# EAGLE schematic Atmega (EAGLE 6.2)
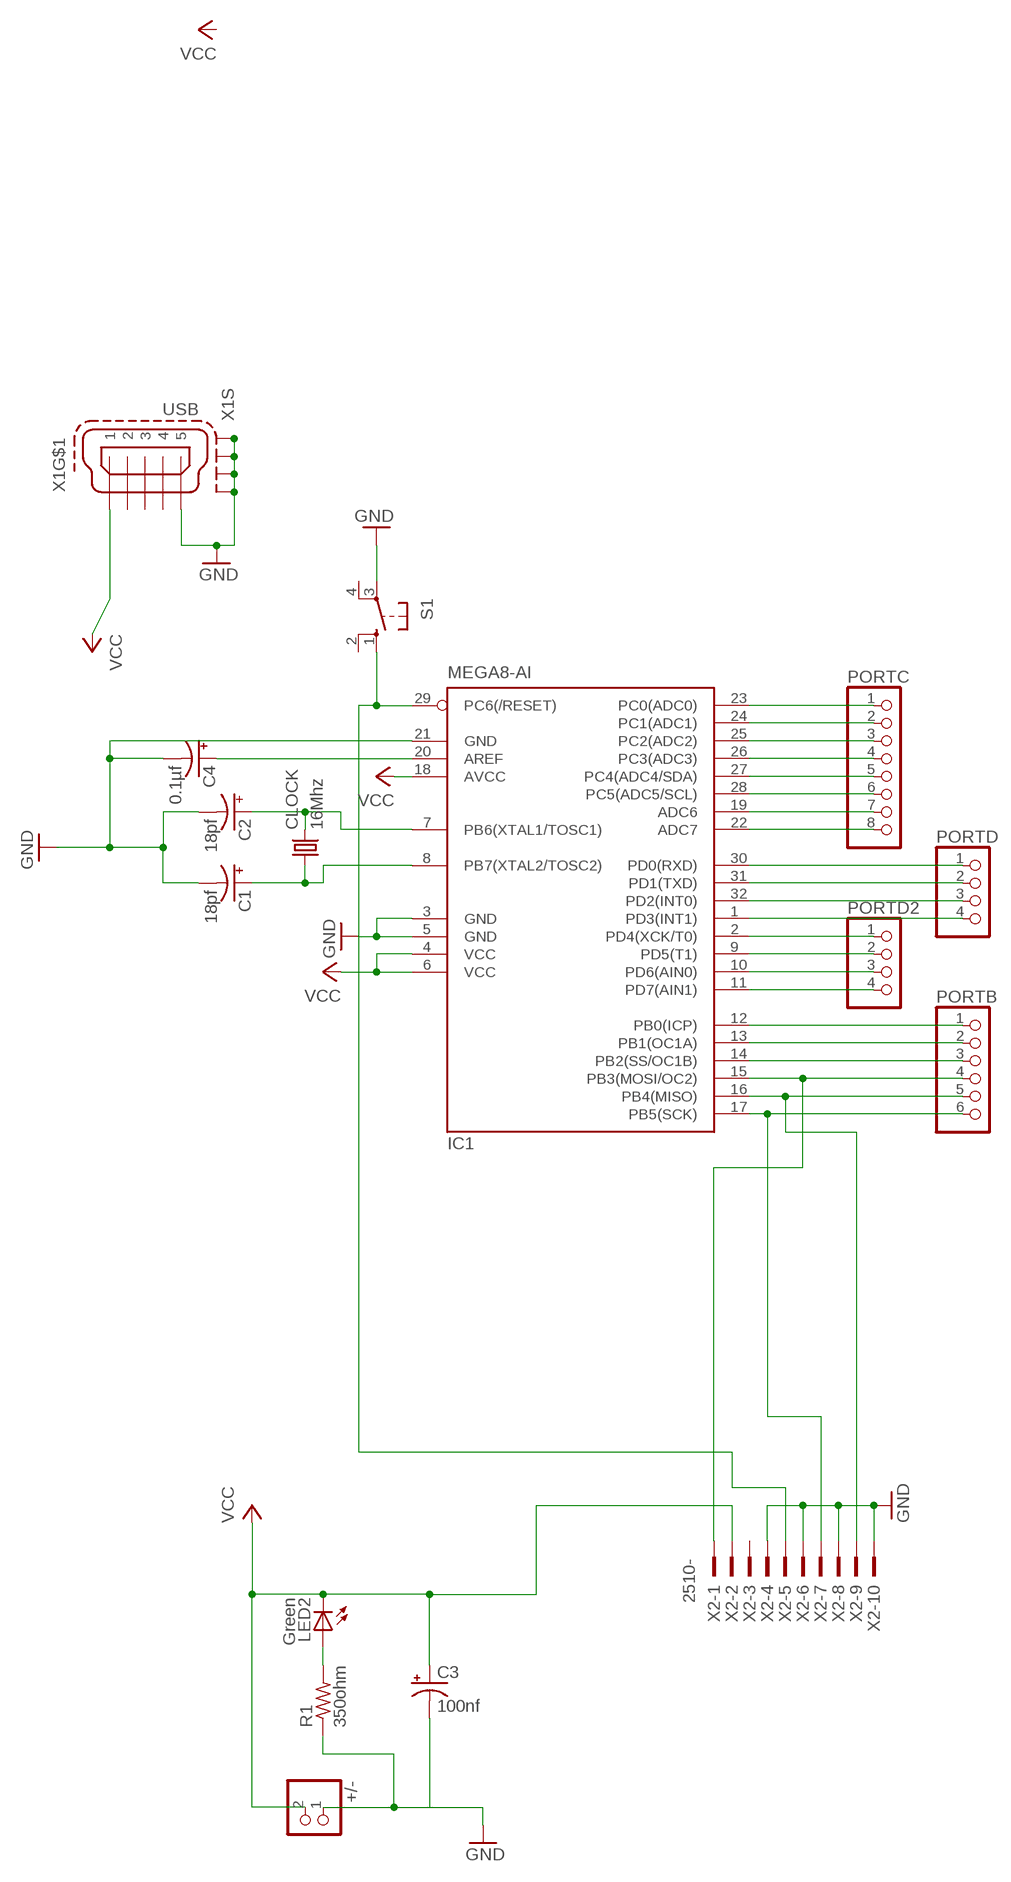
[diagram p0: schematic, sheet 1]

## Parts
+/-  PINHD-1X2  [1X02]
C1  18pf  CPOL-USSMCZ  [SMC_Z]
C2  18pf  CPOL-USSMCZ  [SMC_Z]
C3  100nf  CPOL-USSMCZ  [SMC_Z]
C4  0.1µf  CPOL-USSMCZ  [SMC_Z]
CLOCK  16Mhz  CRYSTALHC49UP  [HC49UP]
IC1  MEGA8-AI  [TQFP32-08]
LED2  Green  LG_T679-E1F1-1  [PLCC2]
PORTB  PINHD-1X6  [1X06]
PORTC  PINHD-1X8  [1X08]
PORTD  PINHD-1X4  [1X04]
PORTD2  PINHD-1X4  [1X04]
R1  350ohm  R-US_M0805  [M0805]
S1  10-XX  [B3F-10XX]
X1  USB  MINI-USB-SCHIELD-32005-201  [32005-201]
X2  2510-  [PAK100/2500-10]

## Nets
GND: +/-.1 C1.- C2.- C3.- C4.- IC1.3(GND) IC1.5(GND) IC1.21(GND) R1.1 S1.3(P) X1.5 X1.M1(S:S1) X1.M2(S:S2) X1.M3(S:S3) X1.M4(S:S4) X2.4 X2.6 X2.8 X2.10
N$1: C2.+ CLOCK.2 IC1.7(PB6(XTAL1/TOSC1))
N$2: IC1.29(PC6(/RESET)) S1.1(S) X2.5
N$3: IC1.30(PD0(RXD)) PORTD.1
N$4: LED2.A R1.2
N$5: IC1.23(PC0(ADC0)) PORTC.1
N$6: IC1.24(PC1(ADC1)) PORTC.2
N$7: C1.+ CLOCK.1 IC1.8(PB7(XTAL2/TOSC2))
N$8: IC1.25(PC2(ADC2)) PORTC.3
N$9: IC1.26(PC3(ADC3)) PORTC.4
N$10: IC1.27(PC4(ADC4/SDA)) PORTC.5
N$11: IC1.28(PC5(ADC5/SCL)) PORTC.6
N$12: IC1.19(ADC6) PORTC.7
N$13: IC1.22(ADC7) PORTC.8
N$14: IC1.31(PD1(TXD)) PORTD.2
N$15: IC1.32(PD2(INT0)) PORTD.3
N$16: IC1.1(PD3(INT1)) PORTD.4
N$17: IC1.2(PD4(XCK/T0)) PORTD2.1
N$18: IC1.9(PD5(T1)) PORTD2.2
N$19: IC1.10(PD6(AIN0)) PORTD2.3
N$20: IC1.11(PD7(AIN1)) PORTD2.4
N$22: IC1.12(PB0(ICP)) PORTB.1
N$23: IC1.13(PB1(OC1A)) PORTB.2
N$25: IC1.14(PB2(SS/OC1B)) PORTB.3
N$26: IC1.15(PB3(MOSI/OC2)) PORTB.4 X2.1
N$27: IC1.16(PB4(MISO)) PORTB.5 X2.9
N$28: IC1.17(PB5(SCK)) PORTB.6 X2.7
N$29: C4.+ IC1.20(AREF)
VCC: +/-.2 C3.+ IC1.4(VCC) IC1.6(VCC) IC1.18(AVCC) LED2.C X1.1 X2.2
Unconnected: S1.2(S1) S1.4(P1) X1.2 X1.3 X1.4 X2.3

## Library data of the parts
+/- = pinhead:PINHD-1X2: PIN HEADER
C1-C4 = rcl:CPOL-US: POLARIZED CAPACITOR, American symbol
CLOCK = crystal:CRYSTAL: CRYSTAL; OC_FARNELL: unknown; OC_NEWARK: unknown
IC1 = atmel:MEGA8: MICROCONTROLLER 8 Kbytes FLASH, 1 kbytes SRAM, 512 bytes EEPROM, USART, 6-channel 10 bit ADC, 2-channel 8 bit ADC Pin compatible with Atmega48, ATMega88, ATMega168 Source: avr.lbr; MPN: ATMEGA8-16AU; OC_FARNELL: 9171371; OC_NEWARK: 73M8863
LED2 = led:*_T679-?-1: LC TOPLED® Low Current LED Source: http://catalog.osram-os.com .. LG_LS_LY_T679_OBS.pdf; COLOR: green
PORTB = pinhead:PINHD-1X6: PIN HEADER
PORTC = pinhead:PINHD-1X8: PIN HEADER
PORTD PORTD2 = pinhead:PINHD-1X4: PIN HEADER
R1 = rcl:R-US_: RESISTOR, American symbol
S1 = switch-omron:10-XX: OMRON SWITCH; MPN: B3F-1000; OC_FARNELL: 176432; OC_NEWARK: 36M3542
X1 = con-cypressindustries:MINI-USB-SCHIELD-: MINI USB-B Conector Source: www.cypressindustries.com; OC_FARNELL: unknown; OC_NEWARK: unknown
X2 = con-3m:2510-: 3M (TM) Pak 100 4-Wall Header Source: 3M; MF: 3M; MPN: 2510-6002UB; OC_FARNELL: 9838244; OC_NEWARK: 46F4725